# EAGLE design Lamp2 (EAGLE 7.7.0)
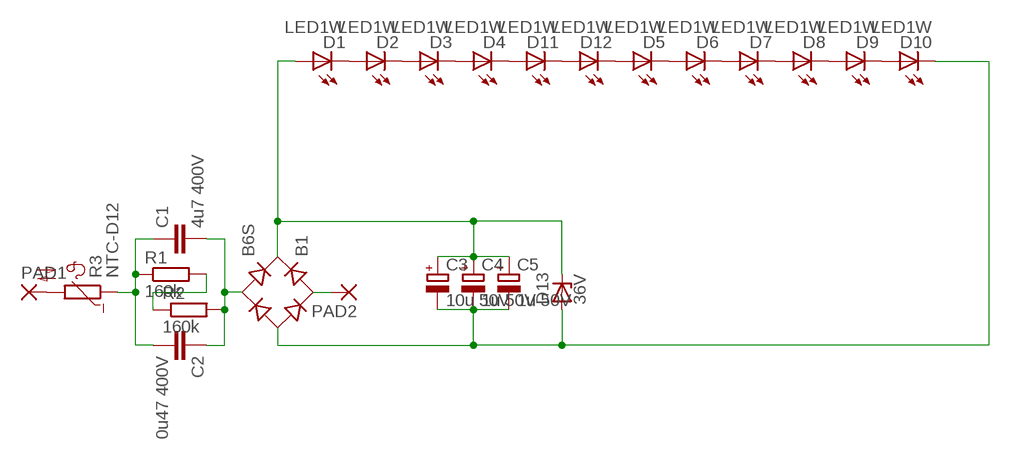
[diagram p0: schematic, sheet 1]

## Parts
B1  B6S  [MBS]
C1  4u7 400V  C-EU275-134X316  [C275-134X316]
C2  0u47 400V  C-EU150-054X183  [C150-054X183]
C3  10u 50V  CPOL-EUE2.5-5  [E2,5-5]
C4  1u 50V  CPOL-EUE2.5-5  [E2,5-5]
C5  1u 50V  CPOL-EUE2.5-5  [E2,5-5]
D1  LED1W  [LED-1W]
D2  LED1W  [LED-1W]
D3  LED1W  [LED-1W]
D4  LED1W  [LED-1W]
D5  LED1W  [LED-1W]
D6  LED1W  [LED-1W]
D7  LED1W  [LED-1W]
D8  LED1W  [LED-1W]
D9  LED1W  [LED-1W]
D10  LED1W  [LED-1W]
D11  LED1W  [LED-1W]
D12  LED1W  [LED-1W]
D13  36V  ZENER-DIODEZD-5  [ZDIO-5]
PAD1  3,81/1,4  [3,81/1,4]
PAD2  3,81/1,4  [3,81/1,4]
R1  160k  R-EU_0204/5  [0204/5]
R2  160k  R-EU_0204/5  [0204/5]
R3  NTC-D12  [NTC-D12]

## Nets
N$1: D1.K(C) D2.A
N$2: D2.K(C) D3.A
N$3: D3.K(C) D4.A
N$4: D4.K(C) D11.A
N$5: D5.K(C) D6.A
N$6: D6.K(C) D7.A
N$7: D7.K(C) D8.A
N$8: D8.K(C) D9.A
N$9: D9.K(C) D10.A
N$10: C1.1 C2.2 R1.1 R3.1
N$11: B1.AC1 PAD2.1(P)
N$12: D11.K(C) D12.A
N$13: D5.A D12.K(C)
N$17: B1.AC2 C1.2 C2.1 R2.2
N$18: R1.2 R2.1
N$19: PAD1.1(P) R3.2
N$20: B1.+ C3.+ C4.+ C5.+ D1.A D13.C
N$21: B1.- C3.- C4.- C5.- D10.K(C) D13.A

## Library data of the parts
B1 = rectifier:B*S: Surface Mount Glass Passivated Bridge Rectifiers Source: Comchip Bridge Rectifiers B05S-G_B10S-G.pdf
C1 C2 = rcl:C-EU: CAPACITOR, European symbol
C3-C5 = rcl:CPOL-EU: POLARIZED CAPACITOR, European symbol
D1-D12 = Namenlos:LED
D13 = diode:ZENER-DIODE: Z-Diode
PAD1 PAD2 = wirepad:3,81/1,4: THROUGH-HOLE PAD
R1 R2 = rcl:R-EU_: RESISTOR, European symbol
R3 = Namenlos:NTC-D12

## Board
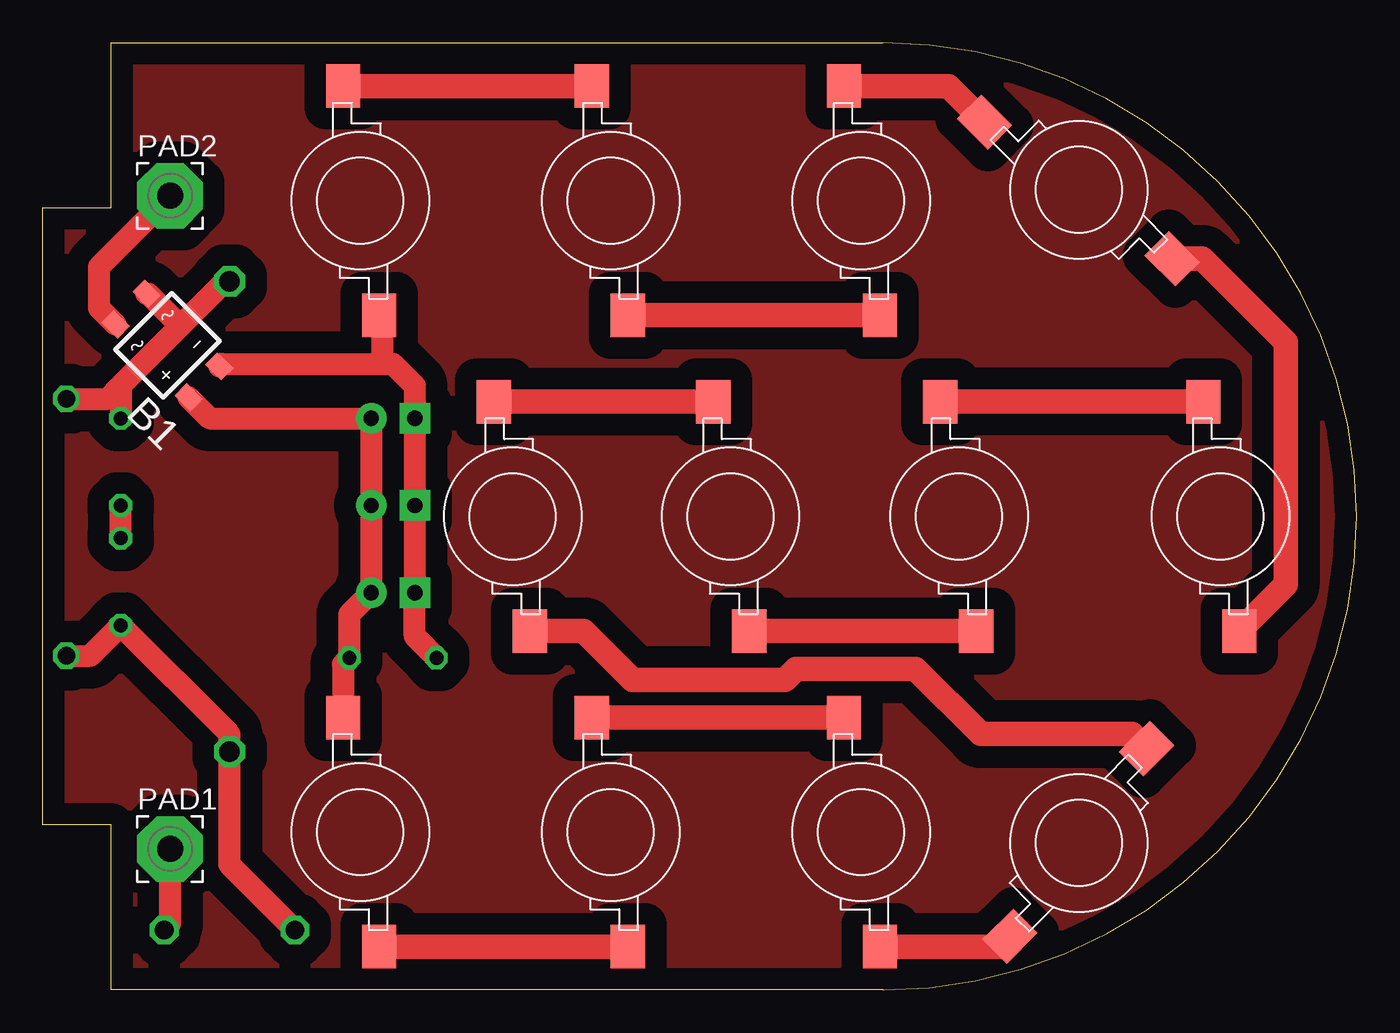
[diagram p1: board, top side]
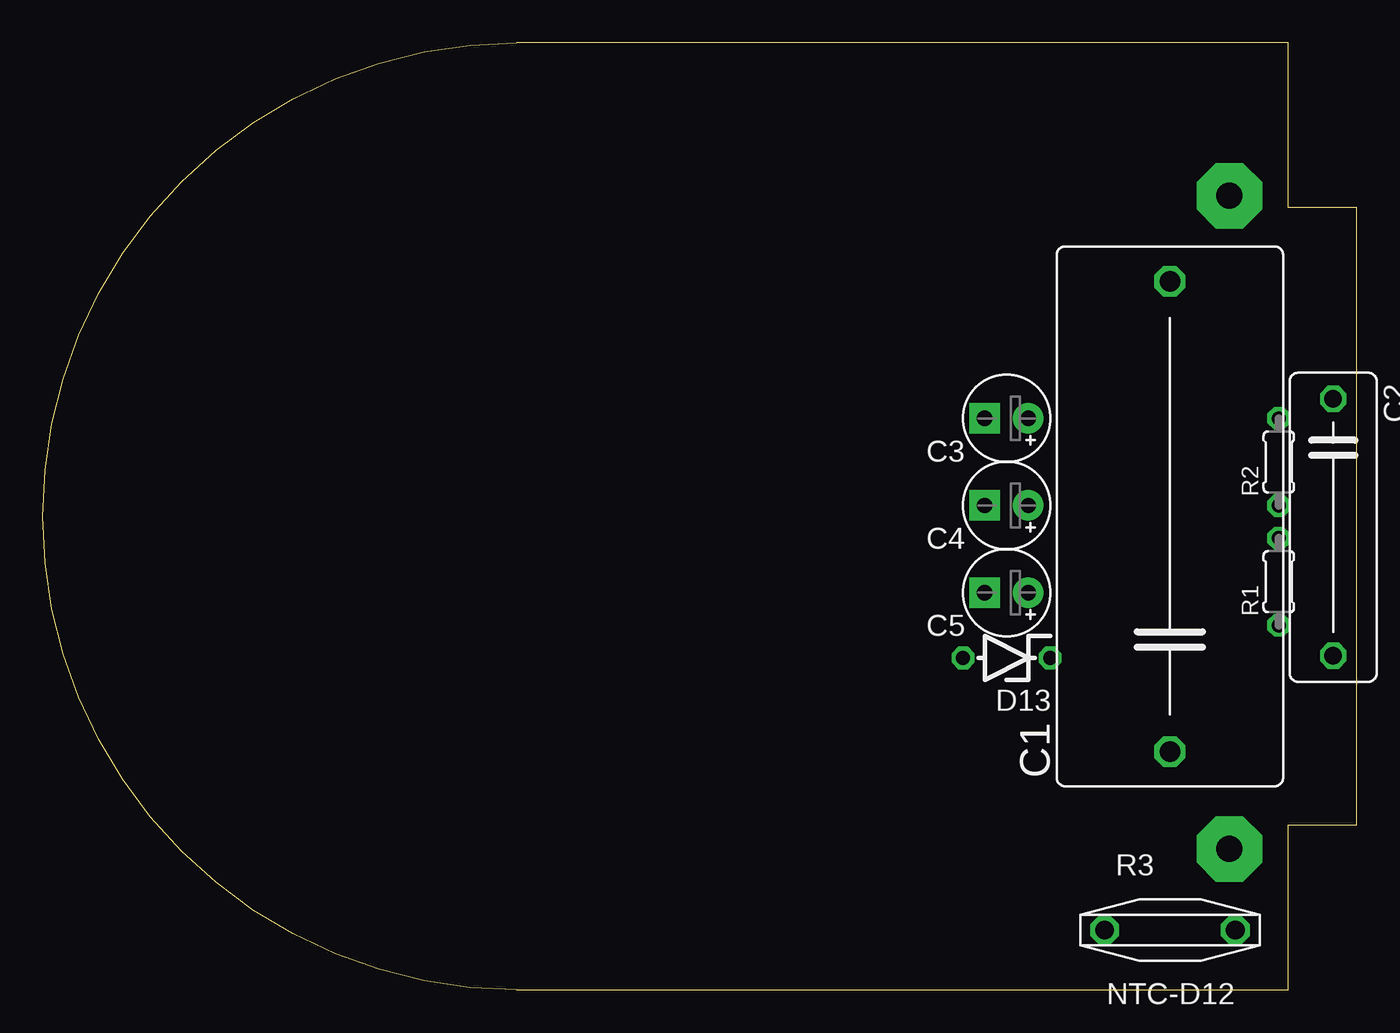
[diagram p2: board, bottom side, seen from below]

Size 76.62 x 55.24 mm. Coordinates in mm from the lower left corner, seen from the top.
Outline: 4,9.62 0,9.62 0,45.62 4,45.62 4,55.24 49,55.24 arc-180 49,0 4,0 4,9.62
Copper layers (1*16): Top 0.035mm / dielectric 1.5mm / Bottom 0.035mm
Design rules "default": minimum track width 10mil, minimum drill 24mil, track to track 8mil, track to pad 8mil, pad to pad 8mil, via to via 8mil, smd to smd 8mil, copper to edge 40mil, drill to drill 8mil, minimum pad ring 10mil, minimum via ring 8mil, stop-mask expansion 4mil, vias tented up to drill 0mil, thermal gap 10mil

### Footprints (pad centres in the part's own frame; a part is rotated, then mirrored left to right if it is on the bottom)
MBS = smd 1 x 1.3: + -1.27,-3; - 1.27,-3; AC1 -1.27,3; AC2 1.27,3
C275-134X316 = drill 1.194 octagon: 1 -13.716,0; 2 13.716,0
C150-054X183 = drill 1.016 octagon: 1 -7.493,0; 2 7.493,0
E2,5-5 = drill 0.9 pad 1.778: + -1.27,0 | drill 0.9 pad 1.778 square: - 1.27,0
LED-1W = smd 2.54 x 2: A -6.685,-1; K 6.685,1.1
ZDIO-5 = drill 0.813 octagon: A 2.54,0; C -2.54,0
3,81/1,4 = drill 1.5 pad 3.81 octagon: 1 0,0
0204/5 = drill 0.813 octagon: 1 -2.54,0; 2 2.54,0
NTC-D12 = drill 1.1 pad 1.676 octagon: 1 -3.81,0; 2 3.81,0

### Placement (x,y rotation side)
B1  7.27,37.59 45 top
C1  10.89,27.62 90 bottom
C2  1.36,26.98 270 bottom
C3  20.41,33.34 180 bottom
C4  20.41,28.26 180 bottom
C5  20.41,23.18 180 bottom
D1  18.51,9.21 270 top
D2  33.11,9.21 90 top
D3  47.72,9.21 270 top
D4  60.42,8.57 45 top
D5  53.44,27.62 90 top
D6  68.67,27.62 270 top
D7  60.42,46.67 135 top
D8  47.72,46.03 270 top
D9  33.11,46.03 90 top
D10  18.51,46.03 270 top
D11  27.4,27.62 90 top
D12  40.1,27.62 270 top
D13  20.41,19.37 180 bottom
PAD1  7.42,8.22 0 top
PAD2  7.42,46.32 0 top
R1  4.54,23.81 90 bottom
R2  4.54,30.8 90 bottom
R3  10.89,3.49 0 bottom

### Tracks (layer width: path | path; a pad name or v marks a point on that pad's centre or on a via)
N$1
  Top 1.422: D1.K D2.A
N$2
  Top 1.422: D2.K D3.A
N$3
  Top 1.422: D3.K 55.78,2.52 D4.A
N$4
  Top 1.422: D11.A 31.55,20.94 34.38,18.09 43.27,18.09 43.91,18.73 50.9,18.73 54.7,14.92 63.52,14.92 D4.K
N$5
  Top 1.422: D6.A D5.K
N$6
  Top 1.422: D7.A 67.61,42.65 72.48,37.78 72.48,23.64 D6.K
N$7
  Top 1.422: D8.A 52.81,52.72 D7.K
N$8
  Top 1.422: D9.A D8.K
N$9
  Top 1.422: D10.A D9.K
N$10
  Top 1.27: C2.2 2.76,19.49 R1.1 10.89,14.92 C1.1 10.89,7.3 R3.1
N$11
  Top 1.27: PAD2.1 3.27,42.17 3.27,39.79 B1.AC1
N$12
  Top 1.422: D11.K D12.A
N$13
  Top 1.422: D12.K D5.A
N$16
  pour Top (isolate 1.27): 0.09,45.4 3.91,45.4 3.91,54.92 50.9,54.92 57.88,53.66 63.59,51.12 69.31,46.03 72.48,42.23 74.39,37.78 76.3,31.43 76.3,25.08 75.66,20 73.12,14.29 69.94,9.21 65.5,5.39 60.42,2.22 55.34,0.95 48.35,-0.32 3.91,-0.32 3.91,9.84 0.09,9.84
N$17
  Top 1.27: B1.AC2 6.15,40.61 7.71,39.05 7.71,38.41 | 7.71,38.41 4.54,35.24 | 4.54,35.24 R2.2 | C2.1 3.78,34.48 4.54,35.24 | C1.2 10.64,41.34 7.71,38.41
N$18
  Top 1.27: R1.2 R2.1
N$19
  Top 1.27: R3.2 7.42,3.83 PAD1.1
N$20
  Top 1.27: B1.+ 9.73,33.34 C3.+ C4.+ C5.+ 17.88,21.91 D13.C 17.51,19 D1.A
N$21
  Top 1.27: B1.- 10.43,36.51 19.78,36.51 | 19.78,36.51 20.41,36.51 21.68,35.24 C3.- C4.- C5.- 21.68,20.64 D13.A | D10.K 19.78,39.18 19.78,36.51

### Text on the board
200bmp: C:/EAGLE-7.7.0/Untitled-1.bmp